# EAGLE schematic Retro_Lite_CM5_Right_PCB_v1 - RP2040 (EAGLE 9.6.1)
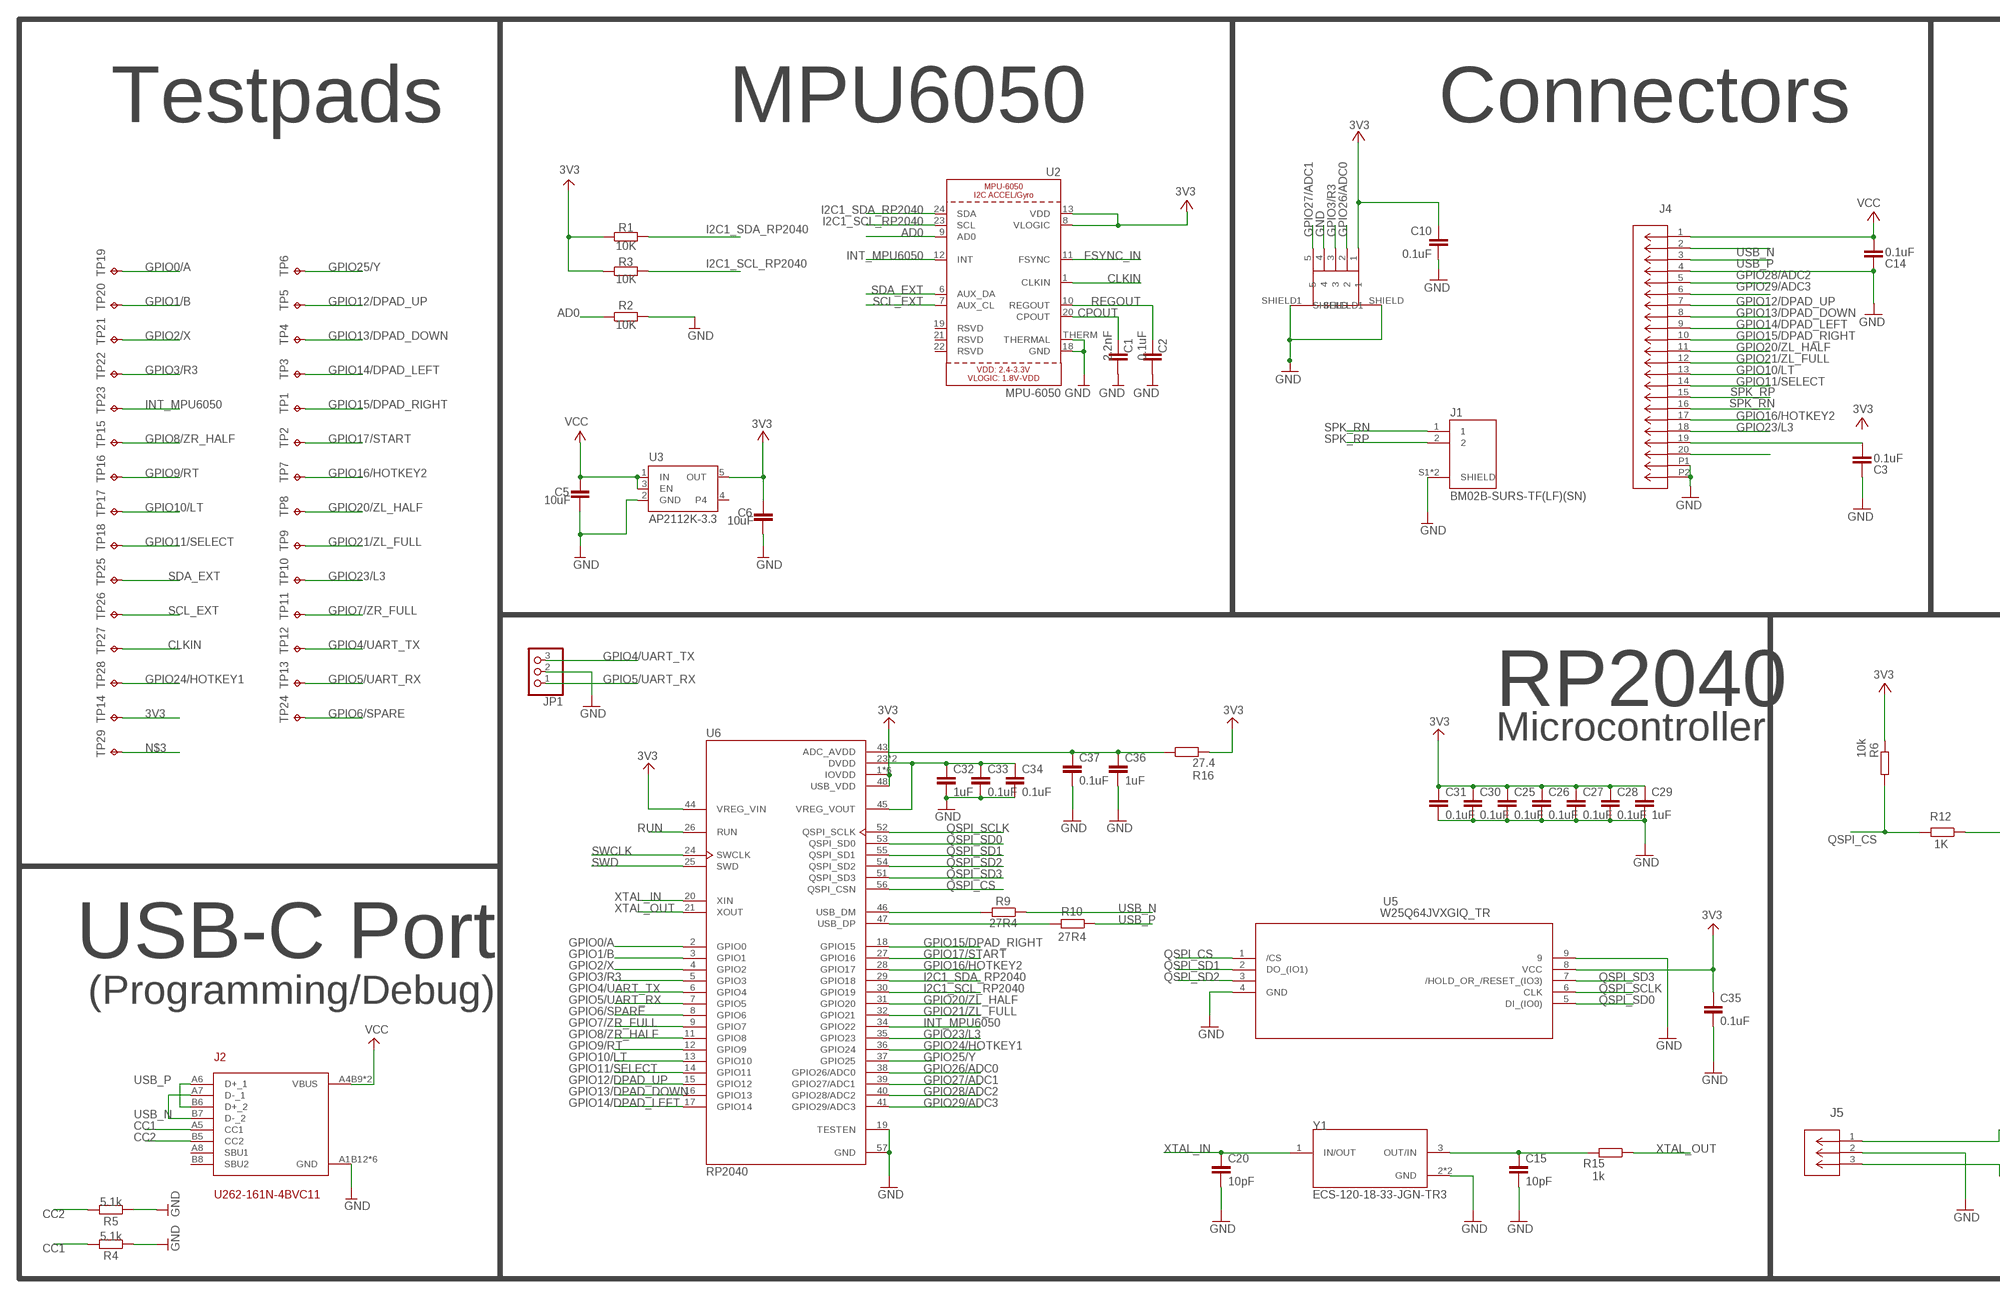
[diagram p0: schematic, sheet 1, part 1 of 2]
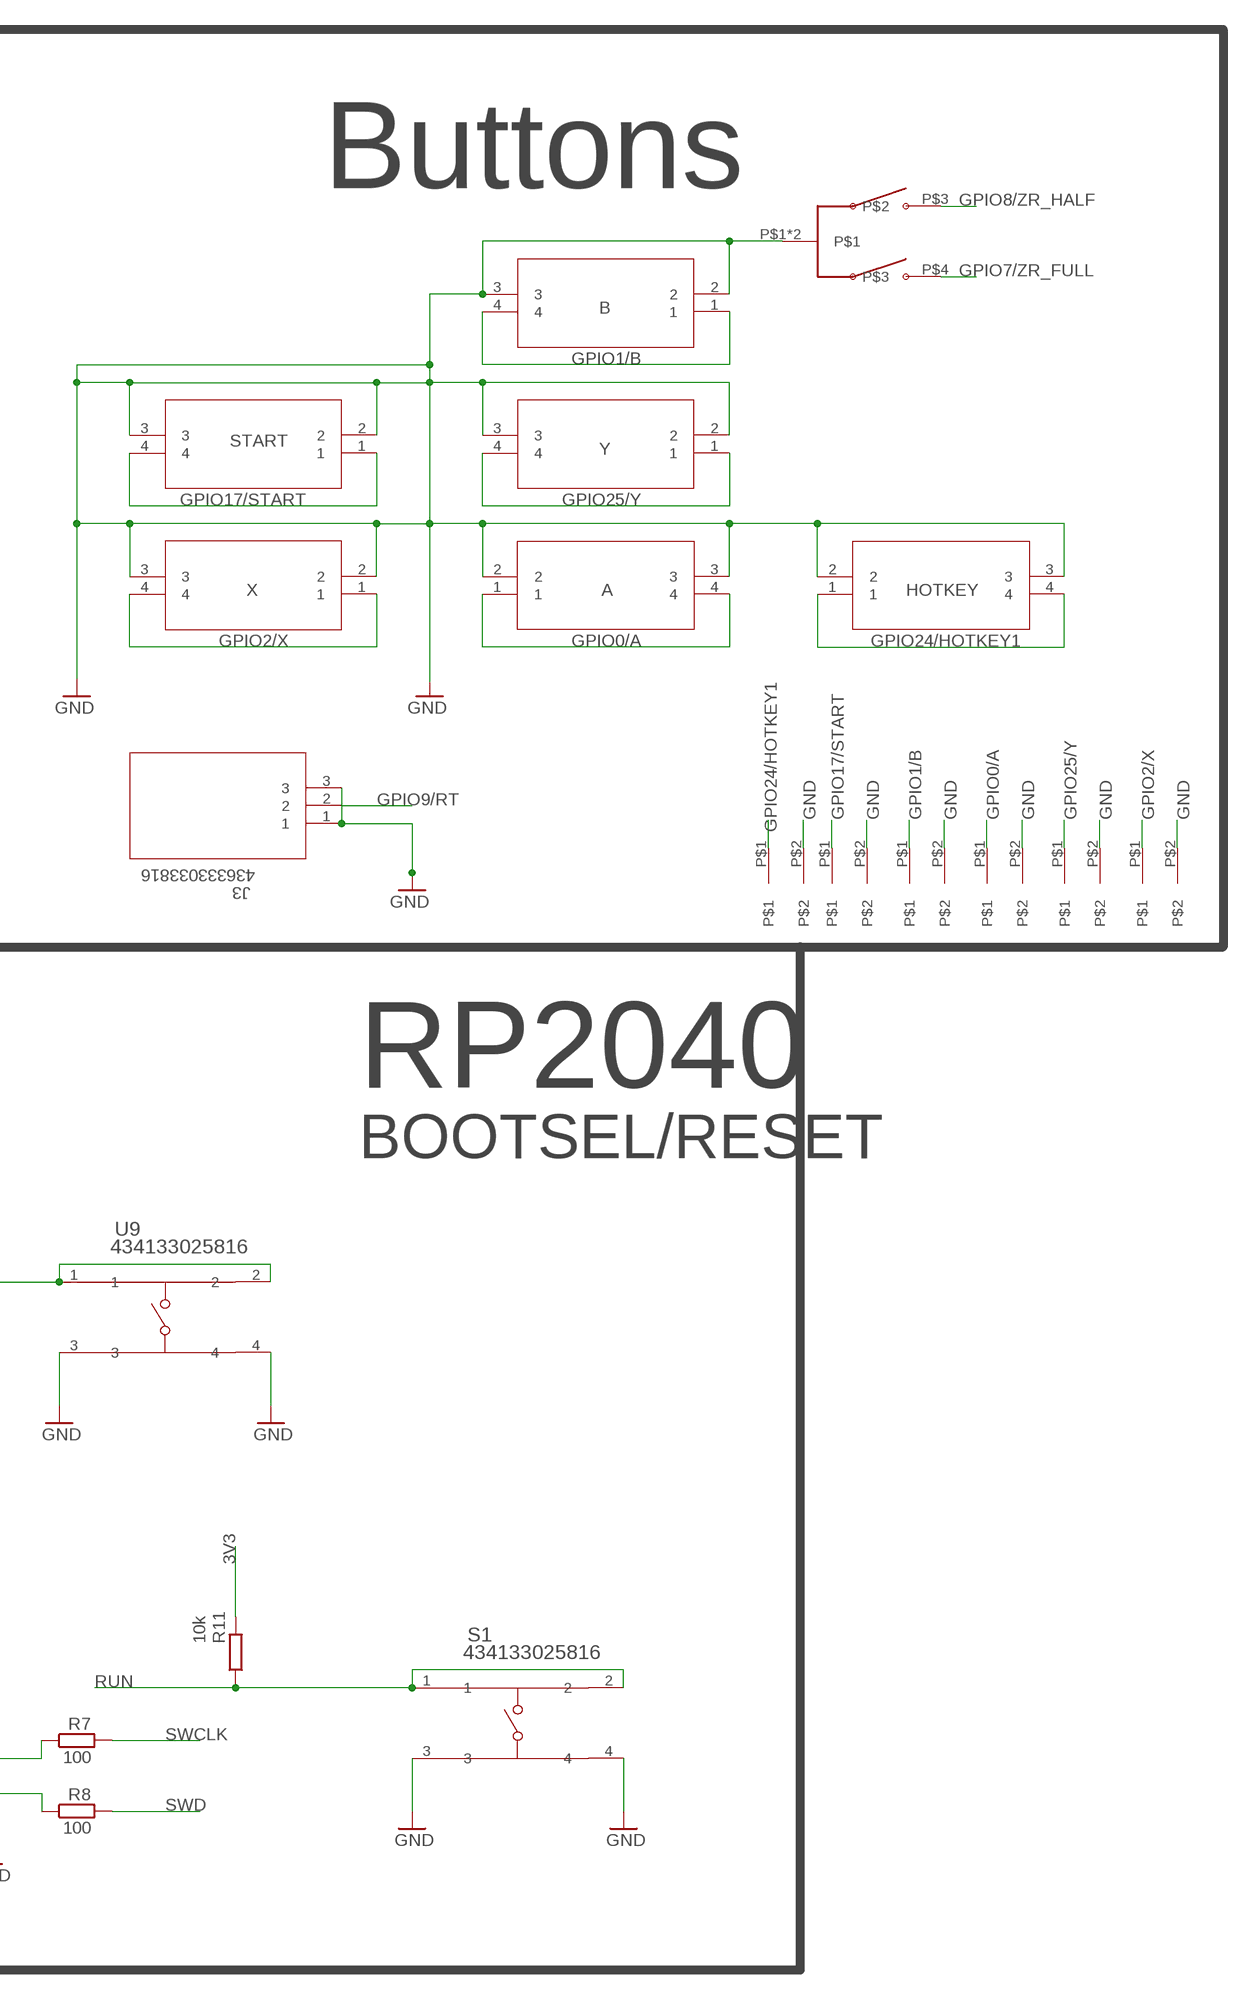
[diagram p1: schematic, sheet 1, part 2 of 2]

## Parts
A  A  EVQ-Q2B03W  [EVQQ2_3]
AA  MEMBRANEBUTTON  [MEMBRANEBUTTON]
B  B  EVQ-Q2B03W  [EVQQ2_3]
BB  MEMBRANEBUTTON  [MEMBRANEBUTTON]
C1  2.2nF  C-EUC0402-YVELTAL  [C0402]
C2  0.1uF  C-EUC0402-YVELTAL  [C0402]
C3  0.1uF  C-EUC0402-YVELTAL  [C0402]
C5  10uF  C-EUC0402-YVELTAL  [C0402]
C6  10uF  C-EUC0402-YVELTAL  [C0402]
C10  0.1uF  C-EUC0402-YVELTAL  [C0402]
C14  0.1uF  C-EUC0402-YVELTAL  [C0402]
C15  10pF  C-EUC0402-YVELTAL  [C0402]
C20  10pF  C-EUC0402-YVELTAL  [C0402]
C25  0.1uF  C-EUC0402-YVELTAL  [C0402]
C26  0.1uF  C-EUC0402-YVELTAL  [C0402]
C27  0.1uF  C-EUC0402-YVELTAL  [C0402]
C28  0.1uF  C-EUC0402-YVELTAL  [C0402]
C29  1uF  C-EUC0402-YVELTAL  [C0402]
C30  0.1uF  C-EUC0402-YVELTAL  [C0402]
C31  0.1uF  C-EUC0402-YVELTAL  [C0402]
C32  1uF  C-EUC0402-YVELTAL  [C0402]
C33  0.1uF  C-EUC0402-YVELTAL  [C0402]
C34  0.1uF  C-EUC0402-YVELTAL  [C0402]
C35  0.1uF  C-EUC0402-YVELTAL  [C0402]
C36  1uF  C-EUC0402-YVELTAL  [C0402]
C37  0.1uF  C-EUC0402-YVELTAL  [C0402]
HOTKEY  A  EVQ-Q2B03W  [EVQQ2_3]
J1  BM02B-SURS-TF(LF)(SN)  [JST_BM02B-SURS-TF(LF)(SN)]
J2  U262-161N-4BVC11  [U262-161N-4BVC11]
J3  436333033816  [CONN3_3033816_WRE]
J4  5034802000  [CON_5034802000_MOL]
J5  BM03B-SRSS-TB(LF)(SN)  [CONN_BM03B-SRSS-TB(LF)(SN)_JST]
JP1  PINHD-1X3  [1X03]
R1  10K  R-EU_R0402  [R0402]
R2  10K  R-EU_R0402  [R0402]
R3  10K  R-EU_R0402  [R0402]
R4  5.1k  R-EU_R0402  [R0402]
R5  5.1k  R-EU_R0402  [R0402]
R6  10k  R-EU_R0402  [R0402]
R7  100  R-EU_R0402  [R0402]
R8  100  R-EU_R0402  [R0402]
R9  27R4  R-EU_R0402  [R0402]
R10  27R4  R-EU_R0402  [R0402]
R11  10k  R-EU_R0402  [R0402]
R12  1K  R-EU_R0402  [R0402]
R15  1k  R-EU_R0402  [R0402]
R16  27.4  R-EU_R0402  [R0402]
S1  434133025816  [SMD_025816_WRE]
START  START  EVQ-Q2B03W  [EVQQ2_3]
START1  MEMBRANEBUTTON  [MEMBRANEBUTTON]
T1  MEMBRANEBUTTON  [MEMBRANEBUTTON]
TP1  TPTP07R  [TP07R]
TP2  TPTP07R  [TP07R]
TP3  TPTP07R  [TP07R]
TP4  TPTP07R  [TP07R]
TP5  TPTP07R  [TP07R]
TP6  TPTP07R  [TP07R]
TP7  TPTP07R  [TP07R]
TP8  TPTP07R  [TP07R]
TP9  TPTP07R  [TP07R]
TP10  TPTP07R  [TP07R]
TP11  TPTP07R  [TP07R]
TP12  TPTP07R  [TP07R]
TP13  TPTP07R  [TP07R]
TP14  TPTP07R  [TP07R]
TP15  TPTP07R  [TP07R]
TP16  TPTP07R  [TP07R]
TP17  TPTP07R  [TP07R]
TP18  TPTP07R  [TP07R]
TP19  TPTP07R  [TP07R]
TP20  TPTP07R  [TP07R]
TP21  TPTP07R  [TP07R]
TP22  TPTP07R  [TP07R]
TP23  TPTP07R  [TP07R]
TP24  TPTP07R  [TP07R]
TP25  TPTP07R  [TP07R]
TP26  TPTP07R  [TP07R]
TP27  TPTP07R  [TP07R]
TP28  TPTP07R  [TP07R]
TP29  TPTP07R  [TP07R]
U2  MPU-6050  [QFN24_4MM_SMSC]
U3  AP2112K-3.3  VREG_SOT23-5  [SOT23-5]
U5  W25Q64JVXGIQ_TR  [DFN_XGIQ_TR_WIN]
U6  RP2040  [QFN40P700X700X90-57N]
U9  434133025816  [SMD_025816_WRE]
U$1  SWITCHSTICK_BREAKOUT  [SWITCHSTICK_BREAKOUT]
U$2  TMHF07  [TMHF07]
X  X  EVQ-Q2B03W  [EVQQ2_3]
XX  MEMBRANEBUTTON  [MEMBRANEBUTTON]
Y  Y  EVQ-Q2B03W  [EVQQ2_3]
Y1  ECS-120-18-33-JGN-TR3  [XTAL_ECS-120-18-33-JGN-TR3]
YY  MEMBRANEBUTTON  [MEMBRANEBUTTON]

## Nets
3V3: C3.2 C6.1 C10.1 C25.1 C26.1 C27.1 C28.1 C29.1 C30.1 C31.1 C35.1 J4.19 R1.1 R3.1 R6.2 R11.2 R16.2 TP14.TP U2.8(VLOGIC) U2.13(VDD) U3.5(OUT) U5.8(VCC) U6.1(IOVDD) U6.10(IOVDD) U6.22(IOVDD) U6.33(IOVDD) U6.42(IOVDD) U6.44(VREG_VIN) U6.48(USB_VDD) U6.49(IOVDD) U$1.1 ; supply symbol labelled 3.3V, VCC
AD0: R2.1 U2.9(AD0)
CC1: J2.A5(CC1) R4.2
CC2: J2.B5(CC2) R5.2
CLKIN: TP27.TP U2.1(CLKIN)
CPOUT: C1.1 U2.20(CPOUT)
FSYNC_IN: U2.11(FSYNC)
GND: A.2 A.3 AA.P$2 B.2 B.3 BB.P$2 C1.2 C2.2 C3.1 C5.2 C6.2 C10.2 C14.1 C15.2 C20.2 C25.2 C26.2 C27.2 C28.2 C29.2 C30.2 C31.2 C32.2 C33.2 C34.2 C35.2 C36.2 C37.2 HOTKEY.2 HOTKEY.3 J1.S1(SHIELD) J1.S2(SHIELD) J2.A1B12(GND) J2.B1A12(GND) J2.SHIELD_1(GND) J2.SHIELD_2(GND) J2.SHIELD_3(GND) J2.SHIELD_4(GND) J3.1 J3.3 J4.4 J4.P1 J4.P2 J5.2 JP1.2 R2.2 R4.1 R5.1 S1.3 S1.4 START1.P$2 START.2 START.3 T1.P$2 U2.18(GND) U2.THERM(THERMAL) U3.2(GND) U5.4(GND) U5.9 U6.19(TESTEN) U6.57(GND) U9.3 U9.4 U$1.4 U$1.SHIELD U$1.SHIELD1 U$2.P$1 U$2.P$2 X.2 X.3 XX.P$2 Y1.2(GND) Y1.4(GND) Y.2 Y.3 YY.P$2
GPIO0/A: A.1 A.4 AA.P$1 TP19.TP U6.2(GPIO0)
GPIO1/B: B.1 B.4 BB.P$1 TP20.TP U6.3(GPIO1)
GPIO2/X: TP21.TP U6.4(GPIO2) X.1 X.4 XX.P$1
GPIO3/R3: TP22.TP U6.5(GPIO3) U$1.3
GPIO4/UART_TX: JP1.3 TP12.TP U6.6(GPIO4)
GPIO5/UART_RX: JP1.1 TP13.TP U6.7(GPIO5)
GPIO6/SPARE: TP24.TP U6.8(GPIO6)
GPIO7/ZR_FULL: TP11.TP U6.9(GPIO7) U$2.P$4
GPIO8/ZR_HALF: TP15.TP U6.11(GPIO8) U$2.P$3
GPIO9/RT: J3.2 TP16.TP U6.12(GPIO9)
GPIO10/LT: J4.13 TP17.TP U6.13(GPIO10)
GPIO11/SELECT: J4.14 TP18.TP U6.14(GPIO11)
GPIO12/DPAD_UP: J4.7 TP5.TP U6.15(GPIO12)
GPIO13/DPAD_DOWN: J4.8 TP4.TP U6.16(GPIO13)
GPIO14/DPAD_LEFT: J4.9 TP3.TP U6.17(GPIO14)
GPIO15/DPAD_RIGHT: J4.10 TP1.TP U6.18(GPIO15)
GPIO16/HOTKEY2: J4.17 TP7.TP U6.28(GPIO17)
GPIO17/START: START1.P$1 START.1 START.4 TP2.TP U6.27(GPIO16)
GPIO20/ZL_HALF: J4.11 TP8.TP U6.31(GPIO20)
GPIO21/ZL_FULL: J4.12 TP9.TP U6.32(GPIO21)
GPIO23/L3: J4.18 TP10.TP U6.35(GPIO23)
GPIO24/HOTKEY1: HOTKEY.1 HOTKEY.4 T1.P$1 TP28.TP U6.36(GPIO24)
GPIO25/Y: TP6.TP U6.37(GPIO25) Y.1 Y.4 YY.P$1
GPIO26/ADC0: U6.38(GPIO26/ADC0) U$1.2
GPIO27/ADC1: U6.39(GPIO27/ADC1) U$1.5
GPIO28/ADC2: J4.5 U6.40(GPIO28/ADC2)
GPIO29/ADC3: J4.6 U6.41(GPIO29/ADC3)
I2C1_SCL_RP2040: R3.2 U2.23(SCL) U6.30(GPIO19)
I2C1_SDA_RP2040: R1.2 U2.24(SDA) U6.29(GPIO18)
INT_MPU6050: TP23.TP U2.12(INT) U6.34(GPIO22)
N$1: C15.1 R15.2 Y1.3(OUT/IN)
N$2: J5.1 R7.1
N$3: J4.20 TP29.TP
N$4: J5.3 R8.1
N$5: C32.1 C33.1 C34.1 U6.23(DVDD) U6.45(VREG_VOUT) U6.50(DVDD)
N$5_N: R9.2 U6.46(USB_DM)
N$5_P: R10.2 U6.47(USB_DP)
N$15: R12.1 U9.1 U9.2
N$17: C36.1 C37.1 R16.1 U6.43(ADC_AVDD)
QSPI_CS: R6.1 R12.2 U5.1(/CS) U6.56(QSPI_CSN)
QSPI_SCLK: U5.6(CLK) U6.52(QSPI_SCLK)
QSPI_SD0: U5.5(DI_(IO0)) U6.53(QSPI_SD0)
QSPI_SD1: U5.2(DO_(IO1)) U6.55(QSPI_SD1)
QSPI_SD2: U5.3(/WP_(IO2)) U6.54(QSPI_SD2)
QSPI_SD3: U5.7(/HOLD_OR_/RESET_(IO3)) U6.51(QSPI_SD3)
REGOUT: C2.1 U2.10(REGOUT)
RUN: R11.1 S1.1 S1.2 U6.26(RUN)
SCL_EXT: TP26.TP U2.7(AUX_CL)
SDA_EXT: TP25.TP U2.6(AUX_DA)
SPK_RN: J1.1 J4.16
SPK_RP: J1.2 J4.15
SWCLK: R7.2 U6.24(SWCLK)
SWD: R8.2 U6.25(SWD)
USB_N [USB2.0]: J2.A7(D-_1) J2.B7(D-_2) J4.2 R9.1
USB_P [USB2.0]: J2.A6(D+_1) J2.B6(D+_2) J4.3 R10.1
VCC: C5.1 C14.2 J2.A4B9(VBUS) J2.B4A9(VBUS) J4.1 U3.1(IN) U3.3(EN) ; supply symbol labelled 3.3V
XTAL_IN: C20.1 U6.20(XIN) Y1.1(IN/OUT)
XTAL_OUT: R15.1 U6.21(XOUT)
Unconnected: J2.A8(SBU1) J2.B8(SBU2) U2.19(RSVD) U2.21(RSVD) U2.22(RSVD) U3.4

## Notes on the sheet
- Testpads | MPU6050 | Connectors | Buttons
- RP2040 | RP2040
- Microcontroller | BOOTSEL/RESET
- USB-C Port
- (Programming/Debug)

## Library data of the parts
A B HOTKEY START X Y = EVQ-Q2B03W:EVQ-Q2B03W; AVAILABILITY: Unavailable; DESCRIPTION: Tactile Switch SPST-NO Top Actuated Surface Mount; MF: Panasonic Electronic; MP: EVQQ2B03W; PACKAGE: None; PRICE: None
AA BB START1 T1 XX YY = Membrane Button:MEMBRANEBUTTON
C1-C3 C5 C6 C10 C14 C15 C20 C25-C37 = rcl:C-EU: CAPACITOR, European symbol
J1 = BM02B-SURS-TF_LF__SN_:BM02B-SURS-TF(LF)(SN): Connector Header Surface Mount 2 position 0.031" (0.80mm); CHECK_PRICES: https://www.snapeda.com/parts/BM02B-SURS-TF(LF)(SN)/JST+Sales+America+Inc./view-part/?ref=eda; DESCRIPTION: Connector Header Surface Mount 2 position 0.031 (0.80mm); MF: JST Sales; MP: BM02B-SURS-TF(LF)(SN); PACKAGE: None; SNAPEDA_LINK: https://www.snapeda.com/parts/BM02B-SURS-TF(LF)(SN)/JST+Sales+America+Inc./view-part/?ref=snap
J2 = gustl_U262-161N-4BVC11:U262-161N-4BVC11
J3 = 5034801700:436333033816; COPYRIGHT: Copyright (C) 2023 Ultra Librarian. All rights reserved.; MANUFACTURER_PART_NUMBER: 436333033816; MFR_NAME: Wurth Electronics
J4 = 5034801700:5034802000; COPYRIGHT: Copyright (C) 2023 Ultra Librarian. All rights reserved.; MANUFACTURER_PART_NUMBER: 5034802000; MFR_NAME: Molex Connector Corporation
J5 = 1-826632-5:BM03B-SRSS-TB(LF)(SN); COPYRIGHT: Copyright (C) 2023 Ultra Librarian. All rights reserved.; MANUFACTURER_PART_NUMBER: BM03B-SRSS-TB(LF)(SN); MFR_NAME: JST
JP1 = pinhead:PINHD-1X3: PIN HEADER
R1-R12 R15 R16 = rcl:R-EU_: RESISTOR, European symbol; SPICEPREFIX: R
S1 U9 = TACT:434133025816; COPYRIGHT: Copyright (C) 2022 Ultra Librarian. All rights reserved.; DIGI-KEY_PART_NUMBER_1: 732-13663-2-ND; DIGI-KEY_PART_NUMBER_2: 732-13663-1-ND; DIGI-KEY_PART_NUMBER_3: 732-13663-6-ND; MANUFACTURER_PART_NUMBER: 434133025816; MFR_NAME: Wurth Electronics
TP1-TP29 = testpad:TP: Test pad
U2 = microbuilder:MPU-6050: MPU-6050 3-Axis Accelerometer/Gyroscope
U3 = microbuilder:VREG_SOT23-5: SOT23-5 Fixed Voltage Regulators Part Current Out V Out V In V Dropout θJA (°C/W) TJ (°C) Digikey Part No. ADP121 150mA 3.3V 3.4-5.5V 0.09V @ 150mA -- -- ADP121-AUJZ33R7CT-ND ADP121 150mA 3.0V 3.1-5.5V 0.09V @ 150mA -- -- ADP121-AUJZ30R7CT-ND ADP122 300mA 3.3V 3.4-5.5V 0.085V @ 300mA -- -- ADP122AUJZ-3.3-R7CT-ND ADP1712 300mA 3.3V 3.5-5.5V 0.17V @ 300mA -- -- ADP1712AUJZ-3.3-R7TR-ND AP7311 (Low Cost) 150mA 3.3V 3.5-6V 0.15V @ 150mA -- -- AP7311-33WG-7DICT-ND LD39015M18R 150mA 1.8V 1.9V-5.5V 0.08V @ 100mA -- -- 497-6977-1-ND LP2985A-33DBVR 150mA 3.3V 3.3-16V 0.28V @ 150mA 206 150 296-18479-1-ND MCP1824T-3302E/OT 300mA 3.3V 3.5V-6V 0.2V @ 300mA -- -- MCP1824T-3302E/OTCT-ND MIC5205-2.5YM5 TR 150mA 2.5V 2.7-16V 0.165V @ 150mA -- -- 576-1257-2-ND MIC5205-3.0YM5 TR 150mA 3.0V 3.2V-16V 0.165V @ 150mA -- -- 576-1258-2-ND MIC5205-3.3YM5 TR 150mA 3.3V 3.5V-16V 0.165V @ 150mA -- -- 576-1259-2-ND TPS780330220 150mA 3.3V+2.2V 3.6-5.5V 250mV Max -- -- 296-23332-1-ND TDA3663/N1,135 100mA 3.3V 3.5-45V 0.18V @ 50mA -- -- 568-5343-1-ND Max operating temp can be calculated using θJA, TJ (max junction temperature), and power in watts. Set the "Maximum Ambient Temperature" until it reaches TJ ("Max Junction Temperature"), which is the absolute limit for safe use of the regulator: Heat Sink Temperature Calculator <http://www.daycounter.com/Calculators/Heat-Sink-Temperature-Calculator.phtml> For example, With 12V source into a 3.3V LP2985 and a 30mA load, we are dissipating (12V-3.3V) * 0.03A = 0.261W. With a θJA of 206 °C/W, a TJ of 150°C, and 261mW we can safely use the chip without a heat sink up to 75°C (=147.1°C Junction Temperature).
U5 = W25Q64JVXGIQ:W25Q64JVXGIQ_TR; COPYRIGHT: Copyright (C) 2022 Ultra Librarian. All rights reserved.; DIGI-KEY_PART_NUMBER_1: 256-W25Q64JVXGIQTR-ND; MANUFACTURER_PART_NUMBER: W25Q64JVXGIQ TR; MFR_NAME: Winbond
U6 = RP2040:RP2040: Check availability <https://pricing.snapeda.com/parts/RP2040/Raspberry%20Pi/view-part?ref=eda>; AVAILABILITY: In Stock; DESCRIPTION: RP2040 chip for Raspberry Pi Pico - ARM® Cortex®-M0+ MCU 32-Bit; MF: Raspberry Pi; MP: RP2040; PACKAGE: None; PRICE: None; PURCHASE-URL: https://pricing.snapeda.com/search/part/RP2040/?ref=eda
U$1 = My_Stuff:SWITCHSTICK_BREAKOUT
U$2 = tmhf07:TMHF07
Y1 = ECS-120-18-33-JGN-TR3:ECS-120-18-33-JGN-TR3: The sub miniature ECX-32 is a compact SMD Crystal. The 3.2 x 2.5 x 0.8 mm ceramic package is ideal for today’s SMD manufacturing environment.; MF: ECS Inc.; MP: ECS-120-18-33-JGN-TR3; PACKAGE: None; PURCHASE-URL: https://pricing.snapeda.com/search/part/ECS-120-18-33-JGN-TR3/?ref=eda

## Net classes
1 USB2.0: width 0.192 mm, clearance 0.114 mm
2 USBEXT: width 0.254 mm